# EAGLE schematic UART-to-ESP32-WROOM_with_JTAG (EAGLE 9.6.2)
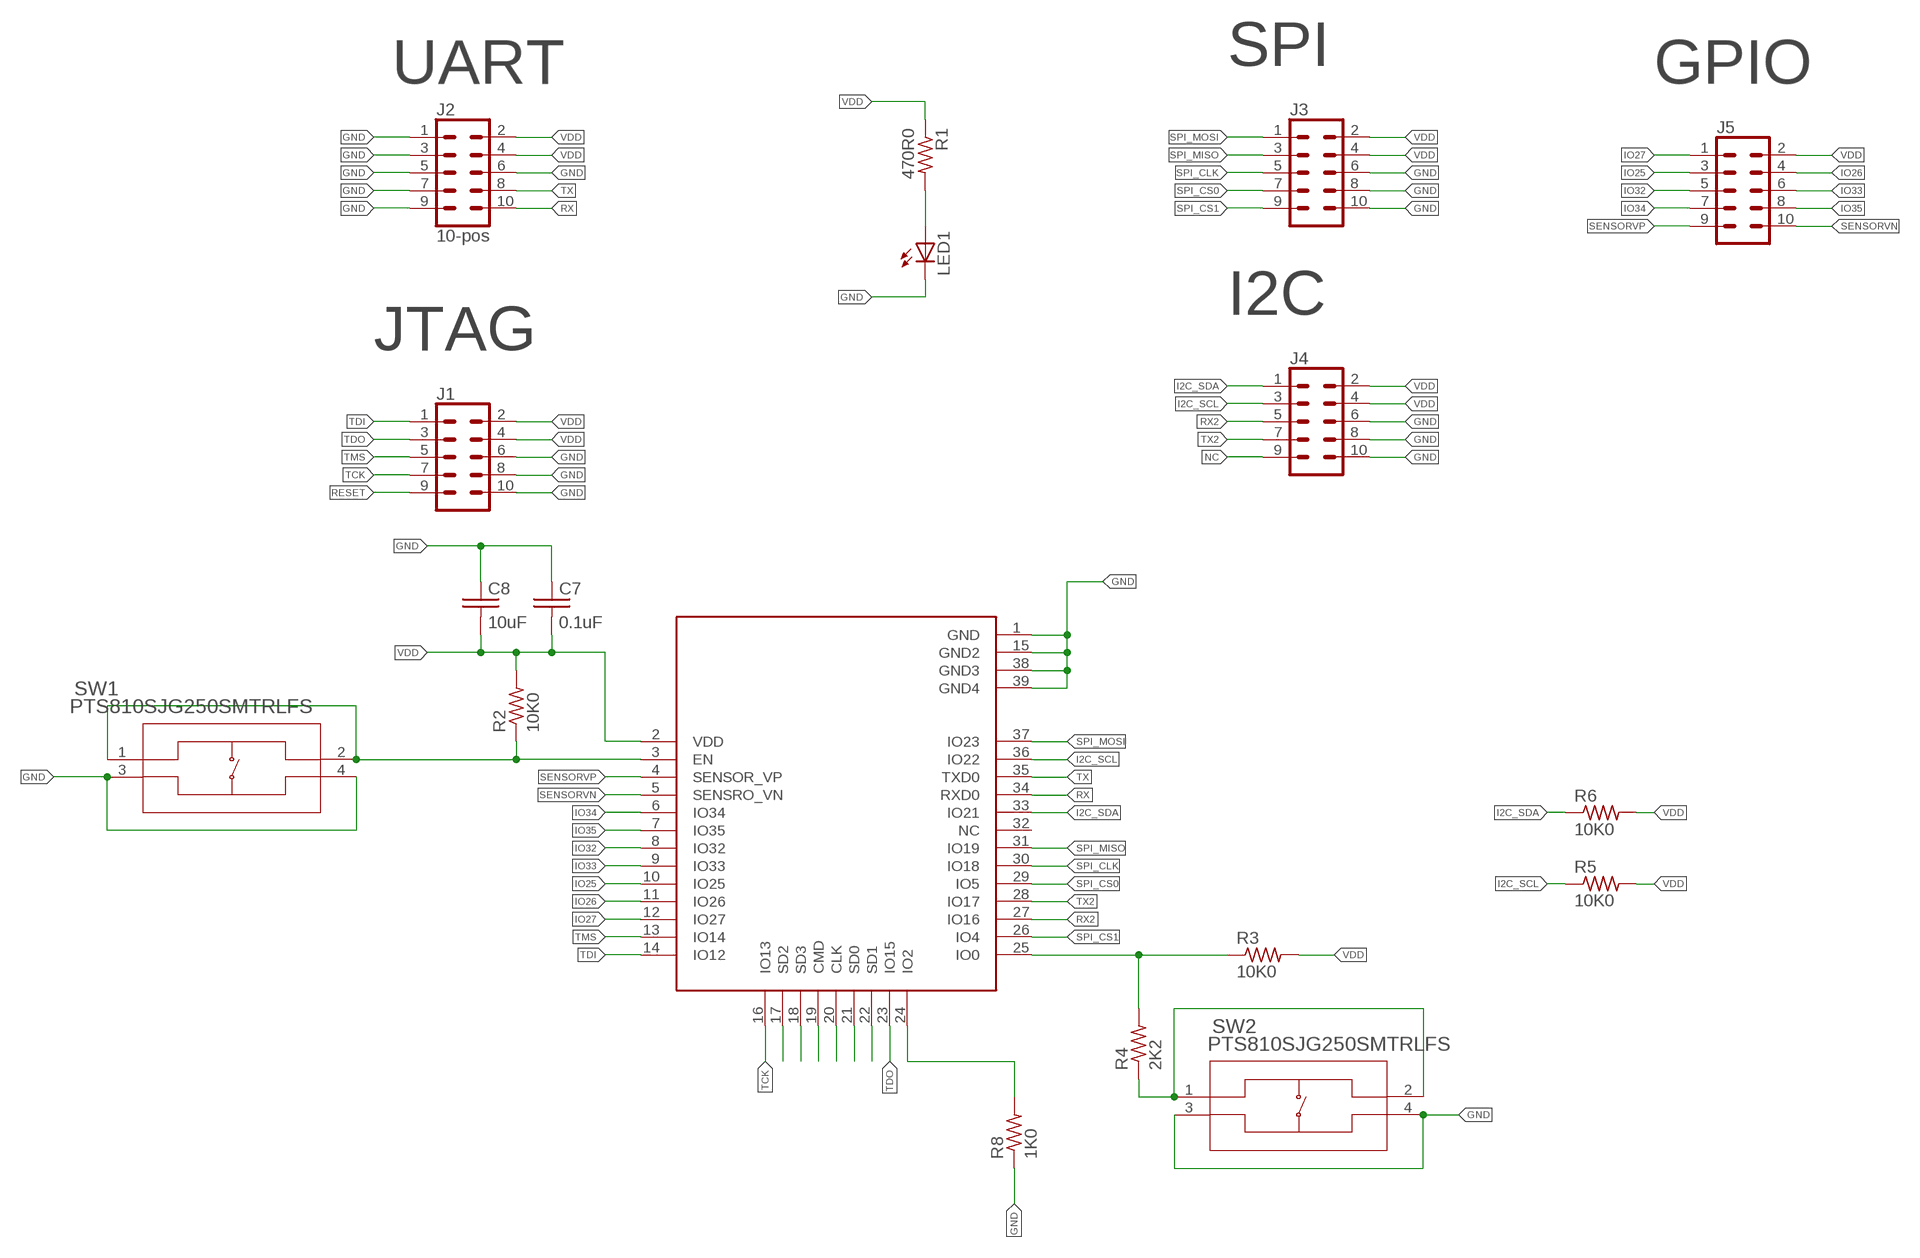
[diagram p0: schematic, sheet 1]

## Parts
C7  0.1uF  C_0402_0.1UF  [0402]
C8  10uF  C_0402_10UF  [0402]
J1  CONN_05X2PTH  [2X5]
J2  10-pos  CONN_05X2_RAPTH  [2X5@1]
J3  CONN_05X2PTH  [2X5]
J4  CONN_05X2PTH  [2X5]
J5  CONN_05X2PTH  [2X5]
LED1  Green  LED_0805_GREEN  [LED_0805_GREEN]
R1  470R0  R_0402_470R0  [0402]
R2  10K0  R_0402_10K0  [0402]
R3  10K0  R_0402_10K0  [0402]
R4  2K2  R_0402_2K2  [0402]
R5  10K0  R_0402_10K0  [0402]
R6  10K0  R_0402_10K0  [0402]
R8  1K0  R_0402_1K0  [0402]
SW1  PTS810SJG250SMTRLFS  [PTS810]
SW2  PTS810SJG250SMTRLFS  [PTS810]
U2  ESP32-WROOM-32D  [ESP32-WROOM-32D]

## Nets
CHIP_PU: R2.P$1 SW1.1 SW1.2 U2.3(EN)
GND: C7.P$1 C8.P$1 J1.6 J1.8 J1.10 J2.1 J2.3 J2.5 J2.6 J2.7 J2.9 J3.6 J3.8 J3.10 J4.6 J4.8 J4.10 LED1.C R8.P$1 SW1.3 SW1.4 SW2.3 SW2.4 U2.1(GND) U2.15(GND2) U2.38(GND3) U2.39(GND4)
I2C_SCL: J4.3 R5.P$1 U2.36(IO22)
I2C_SDA: J4.1 R6.P$1 U2.33(IO21)
IO25: J5.3 U2.10(IO25)
IO26: J5.4 U2.11(IO26)
IO27: J5.1 U2.12(IO27)
IO32: J5.5 U2.8(IO32)
IO33: J5.6 U2.9(IO33)
IO34: J5.7 U2.6(IO34)
IO35: J5.8 U2.7(IO35)
N$1: LED1.A R1.P$2
N$3: R4.P$1 SW2.1 SW2.2
N$18: U2.17(SD2)
N$19: U2.18(SD3)
N$20: U2.19(CMD)
N$21: U2.20(CLK)
N$22: U2.21(SD0)
N$23: U2.22(SD1)
N$25: R8.P$2 U2.24(IO2)
N$26: R3.P$1 R4.P$2 U2.25(IO0)
NC: J4.9
RESET: J1.9
RX: J2.10 U2.34(RXD0)
RX2: J4.5 U2.27(IO16)
SENSORVN: J5.10 U2.5(SENSRO_VN)
SENSORVP: J5.9 U2.4(SENSOR_VP)
SPI_CLK: J3.5 U2.30(IO18)
SPI_CS0: J3.7 U2.29(IO5)
SPI_CS1: J3.9 U2.26(IO4)
SPI_MISO: J3.3 U2.31(IO19)
SPI_MOSI: J3.1 U2.37(IO23)
TCK: J1.7 U2.16(IO13)
TDI: J1.1 U2.14(IO12)
TDO: J1.3 U2.23(IO15)
TMS: J1.5 U2.13(IO14)
TX: J2.8 U2.35(TXD0)
TX2: J4.7 U2.28(IO17)
VDD: C7.P$2 C8.P$2 J1.2 J1.4 J2.2 J2.4 J3.2 J3.4 J4.2 J4.4 J5.2 R1.P$1 R2.P$2 R3.P$2 R5.P$2 R6.P$2 U2.2(VDD)
Unconnected: U2.32(NC)

## Notes on the sheet
- UART | SPI | GPIO
- I2C
- JTAG

## Library data of the parts
C7 = 3D_MIG_Controller:C_0402_0.1UF; PARTNO: CL05F104ZO5NNNC
C8 = 3D_MIG_Controller:C_0402_10UF; PARTNO: CL05A106MP8NUB8
J1 J3-J5 = 3D_MIG_Controller:CONN_05X2: Multi connection point. Often used as Generic Header-pin footprint for 0.1 inch spaced/style header connections For AVR SPI programming port, see special device with nice symbol: "AVR_SPI_PROG_5x2.dev" You can populate with any combo of single row headers, but if you'd like an exact match, check these: 2x5 AVR ICSP Male Header <https://www.sparkfun.com/products/778> (PRT-00778) 2x5 Pin Shrouded Header <https://www.sparkfun.com/products/8506> (PRT-08506) On any of the 0.1 inch spaced packages, you can populate with these: Break Away Headers - Straight <https://www.sparkfun.com/products/116> (PRT-00116) Break Away Male Headers - Right Angle <https://www.sparkfun.com/products/553> (PRT-00553) Female Headers <https://www.sparkfun.com/products/115> (PRT-00115) Break Away Headers - Machine Pin <https://www.sparkfun.com/products/117> (PRT-00117) Break Away Female Headers - Swiss Machine Pin <https://www.sparkfun.com/products/743> (PRT-00743) Special note: the shrouded connector mates well with our 5x2 ribbon cables: 2x5 Pin IDC Ribbon Cable <https://www.sparkfun.com/products/8535> (PRT-08535); PROD_ID: CONN-08499; SF_ID: PRT-0778
J2 = 3D_MIG_Controller:CONN_05X2_RA: Connector Header Through Hole, Right Angle 10 position 0.100" (2.54mm); PARTNO: PH2RA-10-UA
LED1 = 3D_MIG_Controller:LED_0805_GREEN: Green 570nm LED Indication - Discrete 2.2V 0805 (2012 Metric); PARTNO: LG R971-KN-1
R1 = 3D_MIG_Controller:R_0402_470R0; PARTNO: RMCF0402JT470R
R2 R3 R5 R6 = 3D_MIG_Controller:R_0402_10K0; PARTNO: RMCF0402JT10K0
R4 = 3D_MIG_Controller:R_0402_2K2; PARTNO: RMCF0402JT2K20
R8 = 3D_MIG_Controller:R_0402_1K0; PARTNO: CRG0402J1K0
SW1 SW2 = 3D_MIG_Controller:PTS810SJG250SMTRLFS; BUILT_BY: EMA_Cory; COPYRIGHT: Copyright (C) 2018 Accelerated Designs. All rights reserved; DATASHEET: https://www.ckswitches.com/products/tactile/PTS810/#PTS810SJG250SMTRLFS; MANUFACTURER_PART_NUMBER: PTS810SJG250SMTRLFS; VENDOR: C&K
U2 = 3D_MIG_Controller:ESP32-WROOM-32D; PARTNO: ESP32-WROOM-32D